# Altium project 海关全向控制器主控板V3.PrjPcb
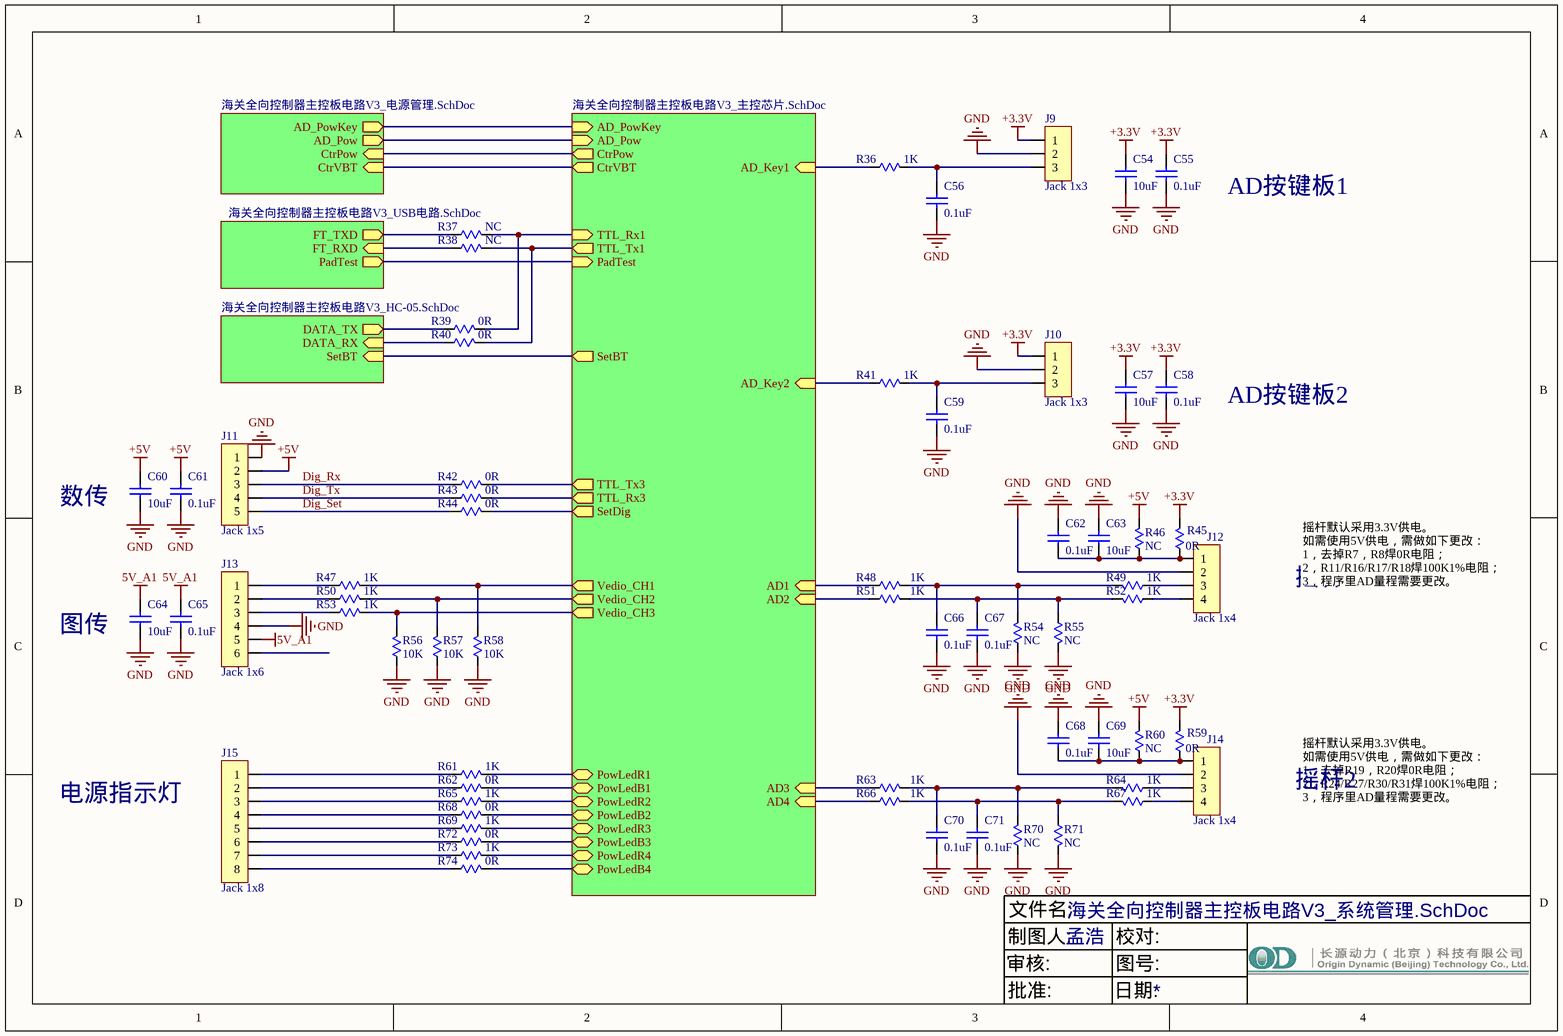
[diagram p0: 海关全向控制器主控板电路V3_系统管理.SchDoc]
5 sheets, 192 parts. Net scope: hierarchical (ports join the sheet entries above them; power ports are global).
Board file: 海关全向控制器主控板电路V3.PcbDoc
Sheets:
  海关全向控制器主控板电路V3_系统管理.SchDoc
    Designator = 海关全向控制器主控板电路V3_电源管理.SchDoc
    Designator = 海关全向控制器主控板电路V3_USB电路.SchDoc
    Designator = 海关全向控制器主控板电路V3_主控芯片.SchDoc
    Designator = 海关全向控制器主控板电路V3_HC-05.SchDoc

## Sheet 海关全向控制器主控板电路V3_系统管理.SchDoc
size A4

### Parts
C54  10uF  [C0805]
C55  0.1uF  [C0805]
C56  0.1uF  [C0805]
C57  10uF  [C0805]
C58  0.1uF  [C0805]
C59  0.1uF  [C0805]
C60  10uF  [C0805]
C61  0.1uF  [C0805]
C62  0.1uF  [C0805]
C63  10uF  [C0805]
C64  10uF  [C0805]
C65  0.1uF  [C0805]
C66  0.1uF  [C0805]
C67  0.1uF  [C0805]
C68  0.1uF  [C0805]
C69  10uF  [C0805]
C70  0.1uF  [C0805]
C71  0.1uF  [C0805]
J9  Jack 1x3  [ZH-3AWD]
J10  Jack 1x3  [ZH-3AWD]
J11  Jack 1x5  [ZH-5AWD]
J12  Jack 1x4  [ZH-4AWD]
J13  Jack 1x6  [ZH-6AWD]
J14  Jack 1x4  [ZH-4AWD]
J15  Jack 1x8  [ZH-8AWD]
R36  1K  [R0805]
R37  NC  [R0805]
R38  NC  [R0805]
R39  0R  [R0805]
R40  0R  [R0805]
R41  1K  [R0805]
R42  0R  [R0805]
R43  0R  [R0805]
R44  0R  [R0805]
R45  0R  [R0805]
R46  NC  [R0805]
R47  1K  [R0805]
R48  1K  [R0805]
R49  1K  [R0805]
R50  1K  [R0805]
R51  1K  [R0805]
R52  1K  [R0805]
R53  1K  [R0805]
R54  NC  [R0805]
R55  NC  [R0805]
R56  10K  [R0805]
R57  10K  [R0805]
R58  10K  [R0805]
R59  0R  [R0805]
R60  NC  [R0805]
R61  1K  [R0805]
R62  0R  [R0805]
R63  1K  [R0805]
R64  1K  [R0805]
R65  1K  [R0805]
R66  1K  [R0805]
R67  1K  [R0805]
R68  0R  [R0805]
R69  1K  [R0805]
R70  NC  [R0805]
R71  NC  [R0805]
R72  0R  [R0805]
R73  1K  [R0805]
R74  0R  [R0805]

### Sub-sheets
Designator = 海关全向控制器主控板电路V3_电源管理.SchDoc: AD_PowKey (out), AD_Pow (out), CtrPow (in), CtrVBT (in)
Designator = 海关全向控制器主控板电路V3_USB电路.SchDoc: FT_RXD (in), FT_TXD (out), PadTest (out)
Designator = 海关全向控制器主控板电路V3_主控芯片.SchDoc: AD_PowKey (in), AD_Pow (in), CtrPow (out), TTL_Rx1 (in), TTL_Tx1 (out), AD_Key1 (in), AD1 (in), AD2 (in), AD3 (in), AD4 (in), TTL_Tx3 (out), TTL_Rx3 (out), Vedio_CH1 (out), Vedio_CH2 (out), Vedio_CH3 (out), AD_Key2 (in), PowLedR1 (bidir), PowLedR2 (bidir), PowLedR3 (bidir), PowLedB1 (bidir), PowLedB2 (bidir), PowLedB3 (bidir), SetDig (out), PowLedR4 (bidir), PowLedB4 (bidir), SetBT (out), PadTest (in), CtrVBT (out)
Designator = 海关全向控制器主控板电路V3_HC-05.SchDoc: DATA_RX (in), DATA_TX (out), SetBT (in)

### Nets
5V_A1: C64.1 C65.1 J13.5
+3.3V: C54.1 C55.1 C57.1 C58.1 J9.1 J10.1 R45.1 R59.1
+5V: C60.1 C61.1 J11.2 R46.1 R60.1
GND: C54.2 C55.2 C56.2 C57.2 C58.2 C59.2 C60.2 C61.2 C62.1 C63.1 C64.2 C65.2 C66.2 C67.2 C68.1 C69.1 C70.2 C71.2 J9.2 J10.2 J11.1 J12.2 J13.4 J14.2 R54.2 R55.1 R56.1 R57.1 R58.1 R70.2 R71.1
AD1: R48.2 ; sheet Designator/AD1
AD2: R51.2 ; sheet Designator/AD2
AD3: R63.2 ; sheet Designator/AD3
AD4: R66.2 ; sheet Designator/AD4
AD_Key1: R36.1 ; sheet Designator/AD_Key1
AD_Key2: R41.1 ; sheet Designator/AD_Key2
AD_Pow: sheet Designator/AD_Pow, sheet Designator/AD_Pow
AD_PowKey: sheet Designator/AD_PowKey, sheet Designator/AD_PowKey
CtrPow: sheet Designator/CtrPow, sheet Designator/CtrPow
CtrVBT: sheet Designator/CtrVBT, sheet Designator/CtrVBT
DATA_RX: R40.2 ; sheet Designator/DATA_RX
DATA_TX: R39.2 ; sheet Designator/DATA_TX
Dig_Rx: J11.3 R42.1
Dig_Set: J11.5 R44.1
Dig_Tx: J11.4 R43.1
PadTest: sheet Designator/PadTest, sheet Designator/PadTest
PowLedB1: R62.2 ; sheet Designator/PowLedB1
PowLedB2: R68.2 ; sheet Designator/PowLedB2
PowLedB3: R72.2 ; sheet Designator/PowLedB3
PowLedB4: R74.2 ; sheet Designator/PowLedB4
PowLedR1: R61.2 ; sheet Designator/PowLedR1
PowLedR2: R65.2 ; sheet Designator/PowLedR2
PowLedR3: R69.2 ; sheet Designator/PowLedR3
PowLedR4: R73.2 ; sheet Designator/PowLedR4
SetBT: sheet Designator/SetBT, sheet Designator/SetBT
SetDig: R44.2 ; sheet Designator/SetDig
TTL_Rx1: R37.1 R39.1 ; sheet Designator/TTL_Rx1
TTL_Rx3: R43.2 ; sheet Designator/TTL_Rx3
TTL_Tx1: R38.1 R40.1 ; sheet Designator/TTL_Tx1
TTL_Tx3: R42.2 ; sheet Designator/TTL_Tx3
Vedio_CH1: R47.2 R58.2 ; sheet Designator/Vedio_CH1
Vedio_CH2: R50.2 R57.2 ; sheet Designator/Vedio_CH2
Vedio_CH3: R53.2 R56.2 ; sheet Designator/Vedio_CH3
NetC56_1: C56.1 J9.3 R36.2
NetC59_1: C59.1 J10.3 R41.2
NetC62_2: C62.2 C63.2 J12.1 R45.2 R46.2
NetC66_1: C66.1 R48.1 R49.1 R54.1
NetC67_1: C67.1 R51.1 R52.1 R55.2
NetC68_2: C68.2 C69.2 J14.1 R59.2 R60.2
NetC70_1: C70.1 R63.1 R64.1 R70.1
NetC71_1: C71.1 R66.1 R67.1 R71.2
NetJ12_3: J12.3 R49.2
NetJ12_4: J12.4 R52.2
NetJ13_1: J13.1 R47.1
NetJ13_2: J13.2 R50.1
NetJ13_3: J13.3 R53.1
NetJ14_3: J14.3 R64.2
NetJ14_4: J14.4 R67.2
NetJ15_1: J15.1 R61.1
NetJ15_2: J15.2 R62.1
NetJ15_3: J15.3 R65.1
NetJ15_4: J15.4 R68.1
NetJ15_5: J15.5 R69.1
NetJ15_6: J15.6 R72.1
NetJ15_7: J15.7 R73.1
NetJ15_8: J15.8 R74.1
NetR37_2: R37.2 ; sheet Designator/FT_TXD
NetR38_2: R38.2 ; sheet Designator/FT_RXD

Not connected (* = marked no-connect by the designer): J13 6

### Notes on the sheet
- AD按键板1
- AD按键板2
- 数传
- 摇杆默认采用3.3V供电。
  如需使用5V供电，需做如下更改：
  1，去掉R7，R8焊0R电阻；
  2，R11/R16/R17/R18焊100K1%电阻；
  3，程序里AD量程需要更改。
- 图传
- 摇杆1
- 摇杆2
- 电源指示灯
- 摇杆默认采用3.3V供电。
  如需使用5V供电，需做如下更改：
  1，去掉R19，R20焊0R电阻；
  2，R24/R27/R30/R31焊100K1%电阻；
  3，程序里AD量程需要更改。
- 文件名:
- 审核:
- 制图人:
- 孟浩
- 校对:
- 图号:
- 批准:
- 日期:

### Library data of the parts
C54-C71 = Cap: Capacitor; Published: 8-Jun-2000; Revision: July-2002: Re-released for DXP Platform.; Publisher: Altium Limited
  C54 C57 C60 C63 C64 C69: Value: 10uF
  C55 C56 C58 C59 C61 C62 C65-C68 C70 C71: Value: 0.1uF
J9 J10 = Jack 1x3: 插座
J11 = Jack 1x5: 插座
J12 J14 = Jack 1x4: 插座
J13 = Jack 1x6: 插座
J15 = Jack 1x8: 插座
R36-R74 = Res: Resistor; Published: 8-Jun-2000; LatestRevisionDate: 04-Mar-2005; LatestRevisionNote: PCB Footprint replaced.; PackageReference: J1-0603; Publisher: Altium Limited
  R36 R41 R47-R53 R63 R64 R66 R67: Value: 1K
  R37 R38 R46 R54 R55 R60 R70 R71: Value: NC
  R39 R40 R42-R45 R59 R62 R68 R72 R74: Value: 0R
  R56-R58: Value: 10K

## Sheet 海关全向控制器主控板电路V3_电源管理.SchDoc
size A4
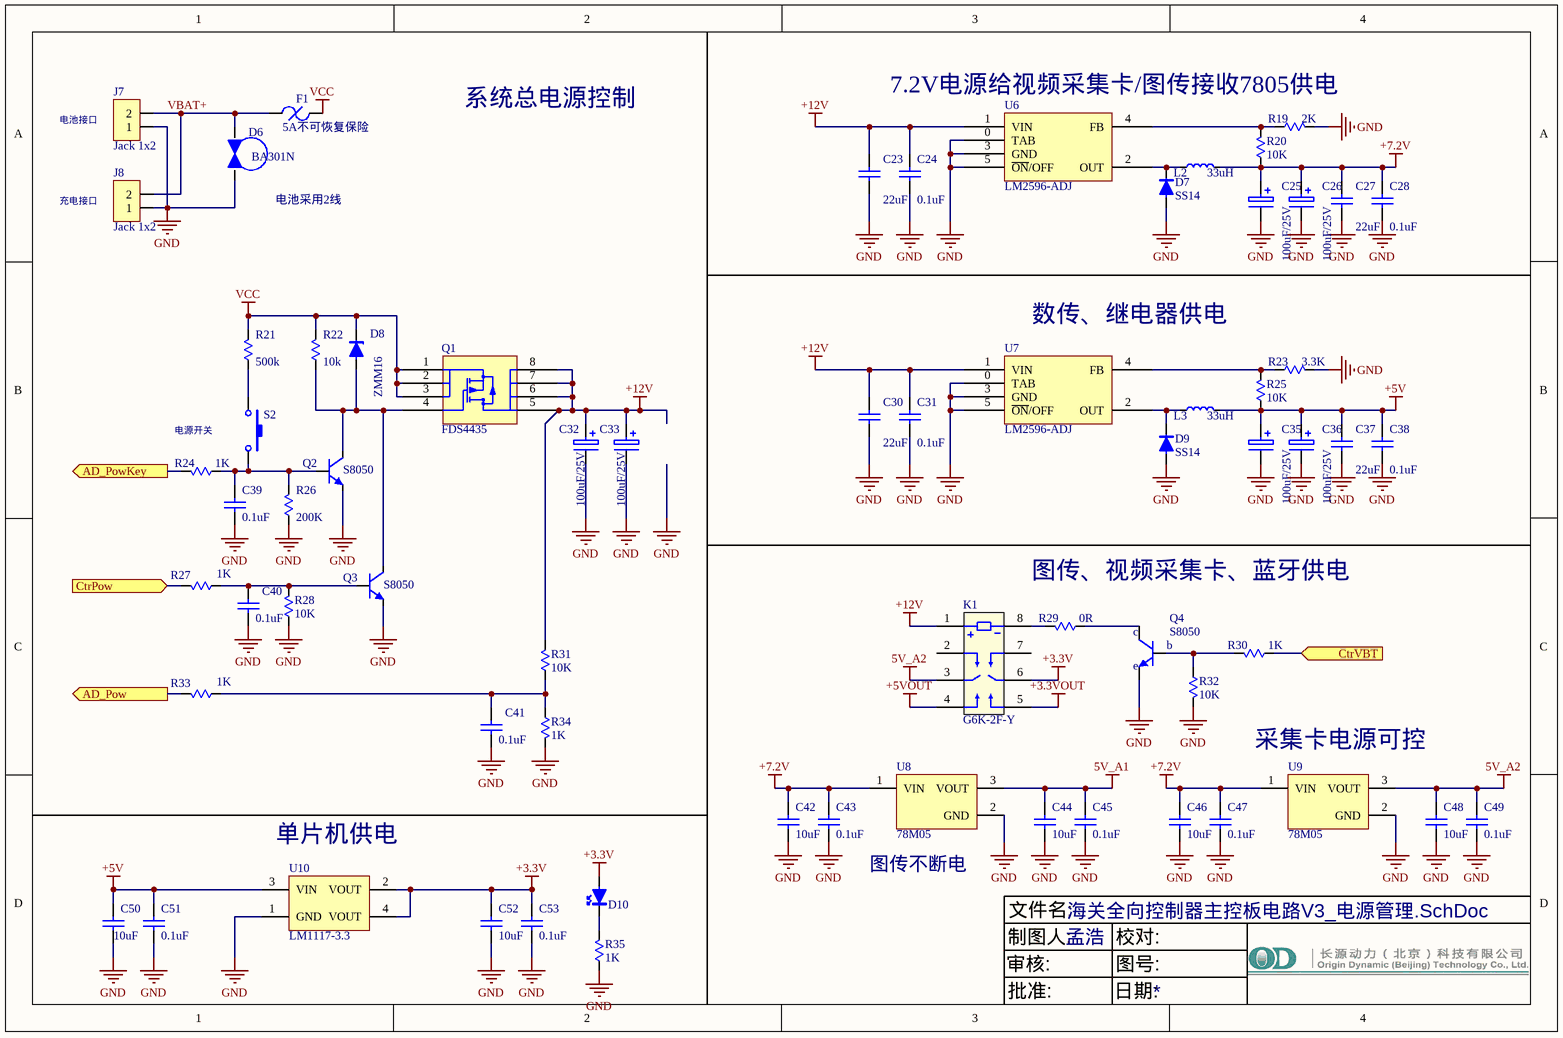
[diagram p1: 海关全向控制器主控板电路V3_电源管理.SchDoc]

### Parts
C23  22uF  [C1210]
C24  0.1uF  [C0805]
C25  100uF/25V  [C7343]
C26  100uF/25V  [C7343]
C27  22uF  [C1210]
C28  0.1uF  [C0805]
C30  22uF  [C1210]
C31  0.1uF  [C0805]
C32  100uF/25V  [C7343]
C33  100uF/25V  [C7343]
C35  100uF/25V  [C7343]
C36  100uF/25V  [C7343]
C37  22uF  [C1210]
C38  0.1uF  [C0805]
C39  0.1uF  [C0805]
C40  0.1uF  [C0805]
C41  0.1uF  [C0805]
C42  10uF  [C0805]
C43  0.1uF  [C0805]
C44  10uF  [C0805]
C45  0.1uF  [C0805]
C46  10uF  [C0805]
C47  0.1uF  [C0805]
C48  10uF  [C0805]
C49  0.1uF  [C0805]
C50  10uF  [C0805]
C51  0.1uF  [C0805]
C52  10uF  [C0805]
C53  0.1uF  [C0805]
D6  BA301N  [BA301N]
D7  SS14  [SMA]
D8  ZMM16  [SOD-80-S]
D9  SS14  [SMA]
D10  LED  [LED0603]  (value not drawn)
F1  5A不可恢复保险  [F1808]
J7  Jack 1x2  [35363-0260]
J8  Jack 1x2  [35363-0260]
K1  G6K-2F-Y  [G6K-2F-Y]
L2  33uH  [L6.6*7.1mm]
L3  33uH  [L6.6*7.1mm]
Q1  FDS4435  [SO8]
Q2  S8050  [SOT-23]
Q3  S8050  [SOT-23]
Q4  S8050  [SOT-23]
R19  2K  [R0805]
R20  10K  [R0805]
R21  500k  [R0805]
R22  10k  [R0805]
R23  3.3K  [R0805]
R24  1K  [R0805]
R25  10K  [R0805]
R26  200K  [R0805]
R27  1K  [R0805]
R28  10K  [R0805]
R29  0R  [R0805]
R30  1K  [R0805]
R31  10K  [R0805]
R32  10K  [R0805]
R33  1K  [R0805]
R34  1K  [R0805]
R35  1K  [R0805]
S2  SW-PB  [ZH-2AWD]  (value not drawn)
U6  LM2596-ADJ  [TO-263-5]
U7  LM2596-ADJ  [TO-263-5]
U8  78M05  [TO-252]
U9  78M05  [TO-252]
U10  LM1117-3.3  [SOT-223]

### Ports
AD_Pow (out), AD_PowKey (out), CtrPow (in), CtrVBT (in)

### Nets
5V_A1: C44.1 C45.2 U8.3(VOUT)
5V_A2: C48.1 C49.2 K1.3 U9.3(VOUT)
+3.3V: C52.1 C53.2 D10.1(A) K1.6 U10.2(VOUT) U10.4(VOUT)
+3.3VOUT: K1.5
+5V: C35.1 C36.1 C37.1 C38.2 C50.1 C51.2 L3.2 R25.1 U10.3(VIN)
+5VOUT: K1.4
+7.2V: C25.1 C26.1 C27.1 C28.2 C42.1 C43.2 C46.1 C47.2 L2.2 R20.1 U8.1(VIN) U9.1(VIN)
+12V: C23.1 C24.2 C30.1 C31.2 C32.1 C33.1 K1.1 Q1.5 Q1.6 Q1.7 Q1.8 R31.1 U6.1(VIN) U7.1(VIN)
GND: C23.2 C24.1 C25.2 C26.2 C27.2 C28.1 C30.2 C31.1 C32.2 C33.2 C35.2 C36.2 C37.2 C38.1 C39.1 C40.1 C41.1 C42.2 C43.1 C44.2 C45.1 C46.2 C47.1 C48.2 C49.1 C50.2 C51.1 C52.2 C53.1 D6.2 D7.1(A) D9.1(A) J7.1 J8.1 Q2.2(E) Q3.2(E) Q4.2(e) R19.2 R23.2 R26.2 R28.2 R32.2 R34.1 R35.1 U6.0(TAB) U6.3(GND) U6.5(~{ON}/OFF) U7.0(TAB) U7.3(GND) U7.5(~{ON}/OFF) U8.2(GND) U9.2(GND) U10.1(GND)
VCC: D8.2(K) F1.2 Q1.1 Q1.2 Q1.3 R21.2 R22.2
AD_Pow: R33.1 ; port AD_Pow
AD_PowKey: R24.1 ; port AD_PowKey
CtrPow: R27.1 ; port CtrPow
CtrVBT: R30.1 ; port CtrVBT
VBAT+: D6.1 F1.1 J7.2 J8.2
NetC39_2: C39.2 Q2.1(B) R24.2 R26.1 S2.2
NetC40_2: C40.2 Q3.1(B) R27.2 R28.1
NetC41_2: C41.2 R31.2 R33.2 R34.2
NetD7_2: D7.2(K) L2.1 U6.2(OUT)
NetD8_1: D8.1(A) Q1.4 Q2.3(C) Q3.3(C) R22.1
NetD9_2: D9.2(K) L3.1 U7.2(OUT)
NetD10_2: D10.2(K) R35.2
NetK1_8: K1.8 R29.2
NetQ4_1: Q4.1(b) R30.2 R32.1
NetQ4_3: Q4.3(c) R29.1
NetR19_1: R19.1 R20.2 U6.4(FB)
NetR21_1: R21.1 S2.1
NetR23_1: R23.1 R25.2 U7.4(FB)

Not connected (* = marked no-connect by the designer): K1 2 7

### Notes on the sheet
- 系统总电源控制
- (near U6) 7.2V电源给视频采集卡/图传接收7805供电
- 电池接口
- 充电接口
- (near D6) 电池采用2线
- (near U7) 数传、继电器供电
- (near R24) 电源开关
- 图传、视频采集卡、蓝牙供电
- (near U9) 采集卡电源可控
- (near U10) 单片机供电
- 图传不断电
- 文件名:
- 审核:
- 制图人:
- 孟浩
- 校对:
- 图号:
- 批准:
- 日期:

### Library data of the parts
C23 C24 C27 C28 C30 C31 C37-C53 = CAP: Published: 8-Jun-2000; LatestRevisionDate: 17-Jul-2002; LatestRevisionNote: Re-released for DXP Platform.; PackageReference: RAD-0.3; Publisher: Altium Limited
  C23 C27 C30 C37: Value: 22uF
  C24 C28 C31 C38-C41 C43 C45 C47 C49 C51 C53: Value: 0.1uF
  C42 C44 C46 C48 C50 C52: Value: 10uF
C25 C26 C35 C36 = ELECTRO: Electrolytic Capacitor
C32 C33 = Cap Poll
D7 D9 = Diode-Switch: Silicon Epitaxial Planar Diodes
D8 = DIODE-ZENER: Small Signal Zener Diodes
F1 = Fuse2
J7 J8 = Jack 1x2: 插座
L2 L3 = INDUCTOR: Code_IEC: 1005; Published: 8-Jun-2000; LatestRevisionDate: 17-Jul-2002; LatestRevisionNote: Re-released for DXP Platform.; PackageReference: 0402-A; Publisher: Altium Limited; Code_JEITA: 0402; Value: 33uH
Q2 Q3 = NPN: NPN General Purpose Amplifier; Published: 8-Jun-2000; LatestRevisionDate: 15-Jan-2003; LatestRevisionNote: PCB Footprint 'BCY-W3/D4.7' replaced; DatasheetDocument: 1997; PackageDocument: Sep-1998; PackageReference: TO-92A; Publisher: Altium Limited; Code_JEDEC: TO-92A; ComponentLink1Description: Manufacturer Link; ComponentLink1URL: http://www.fairchildsemi.com/; ComponentLink2Description: Datasheet; ComponentLink2URL: http://www.fairchildsemi.com/ds/2N%2F2N3904.pdf
Q4 = S8050: NPN triode, 0.5A Max
R19 R20 R23 R25 R29 R30 R32 = RES: Resistor; Published: 8-Jun-2000; LatestRevisionDate: 17-Jul-2002; LatestRevisionNote: Re-released for DXP Platform.; PackageReference: AXIAL-0.3; Publisher: Altium Limited
  R19: Value: 2K
  R20 R25: Value: 10K
  R23: Value: 3.3K
R21 R22 R24 R26-R28 R31 R33-R35 = Res: Resistor; Published: 8-Jun-2000; LatestRevisionDate: 04-Mar-2005; LatestRevisionNote: PCB Footprint replaced.; PackageReference: J1-0603; Publisher: Altium Limited
  R21: Value: 500k
  R22: Value: 10k
  R26: Value: 200K
  R27 R33-R35: Value: 1K
  R28 R31: Value: 10K
S2 = SW-PB: Switch; Published: 24-Mar-1999; LatestRevisionDate: 17-Jul-2002; LatestRevisionNote: Re-released for DXP Platform.; PackageReference: SPST-2; Publisher: Altium Limited; PackageDescription: Switch; 2 Leads
U6 U7 = LM25x6-5: LM2596-5;LM2576-5
U10 = LM1117: 800mA Linear Voltage Regulator

## Sheet 海关全向控制器主控板电路V3_USB电路.SchDoc
size A4
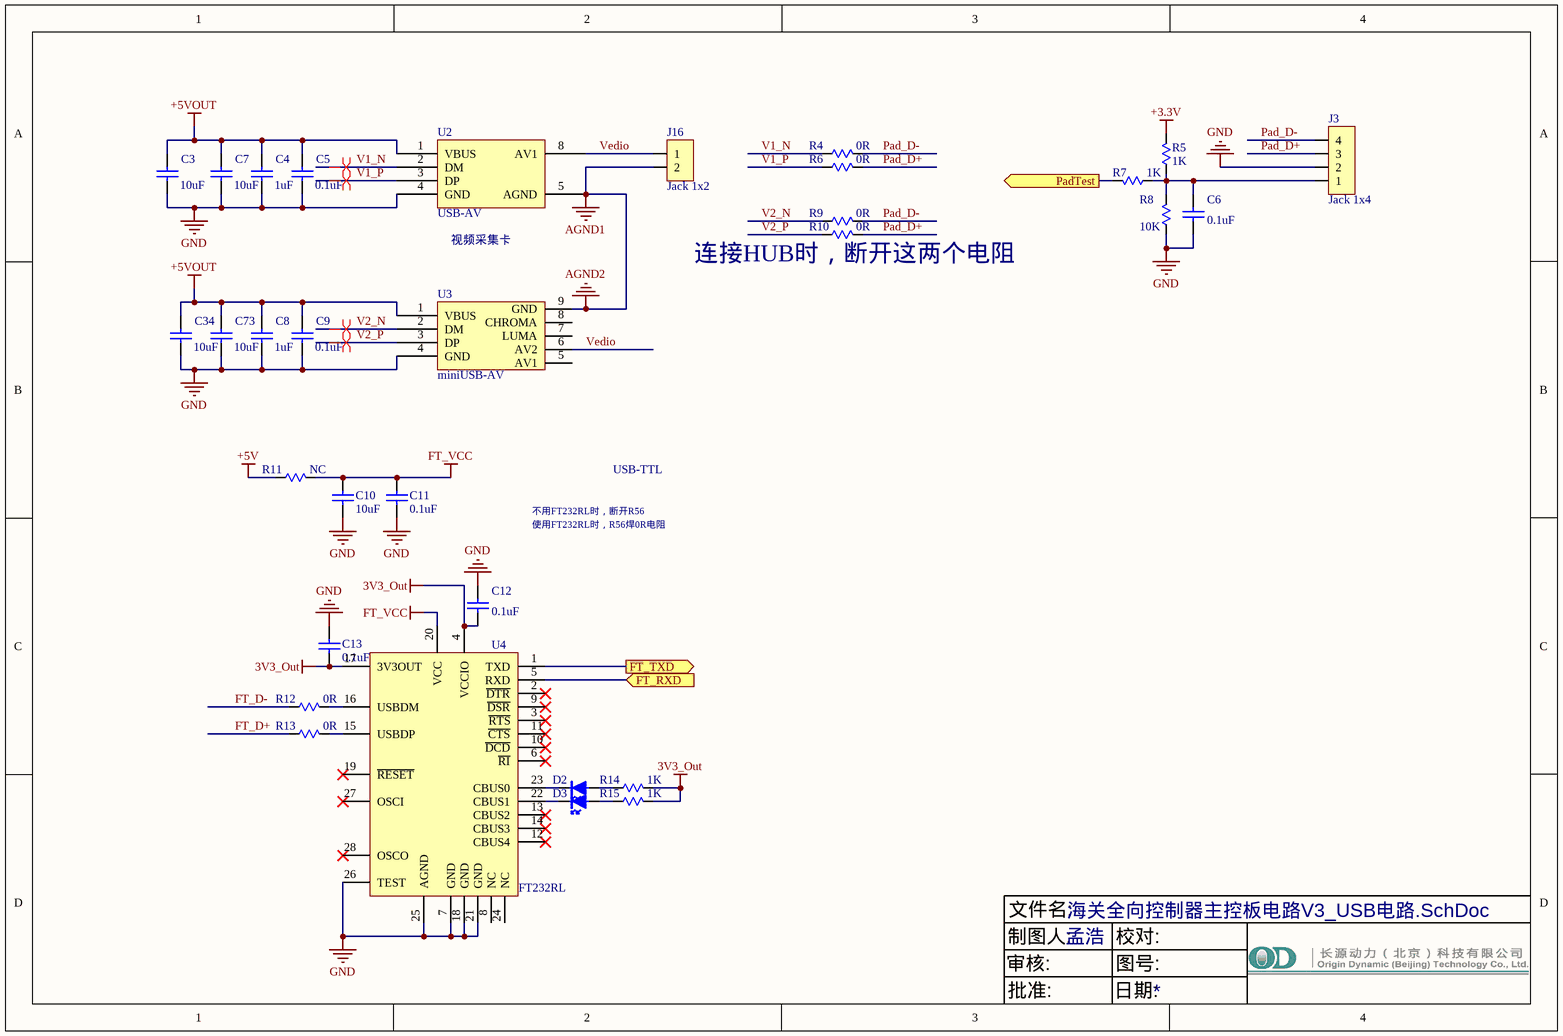
[diagram p2: 海关全向控制器主控板电路V3_USB电路.SchDoc]

### Parts
C3  10uF  [C0805]
C4  1uF  [C0805]
C5  0.1uF  [C0805]
C6  0.1uF  [C0805]
C7  10uF  [C0805]
C8  1uF  [C0805]
C9  0.1uF  [C0805]
C10  10uF  [C0805]
C11  0.1uF  [C0805]
C12  0.1uF  [C0805]
C13  0.1uF  [C0805]
C34  10uF  [C0805]
C73  10uF  [C0805]
D2  LED  [LED0603]  (value not drawn)
D3  LED  [LED0603]  (value not drawn)
J3  Jack 1x4  [35363-0460]
J16  Jack 1x2  [35363-0260]
R4  0R  [R0805]
R5  1K  [R0805]
R6  0R  [R0805]
R7  1K  [R0805]
R8  10K  [R0805]
R9  0R  [R0805]
R10  0R  [R0805]
R11  NC  [R0805]
R12  0R  [R0805]
R13  0R  [R0805]
R14  1K  [R0805]
R15  1K  [R0805]
U2  USB-AV  [USB-AV]
U3  miniUSB-AV  [miniUSB-AV]
U4  FT232RL  [SSOP-28]

### Ports
FT_RXD (in), FT_TXD (out), PadTest (out)

### Nets
3V3_Out: C12.2 C13.1 R14.1 R15.1 U4.4(VCCIO) U4.17(3V3OUT)
+3.3V: R5.1
+5V: R11.2
+5VOUT: C3.1 C4.1 C5.2 C7.1 C8.1 C9.2 C34.1 C73.1 U2.1(VBUS) U3.1(VBUS)
AGND1: J16.2 U2.5(AGND) U3.9(GND)  [also labelled AGND2]
FT_VCC: C10.1 C11.2 R11.1 U4.20(VCC)
GND: C3.2 C4.2 C5.1 C6.2 C7.2 C8.2 C9.1 C10.2 C11.1 C12.1 C13.2 C34.2 C73.2 J3.2 R8.2 U2.4(GND) U3.4(GND) U4.7(GND) U4.18(GND) U4.21(GND) U4.25(AGND) U4.26(TEST)
FT_D+: R13.2
FT_D-: R12.2
Pad_D+: J3.3 R6.1 R10.1
Pad_D-: J3.4 R4.1 R9.1
PadTest: R7.1 ; port PadTest
V1_N: R4.2 U2.2(DM)
V1_P: R6.2 U2.3(DP)
V2_N: R9.2 U3.2(DM)
V2_P: R10.2 U3.3(DP)
Vedio: J16.1 U2.8(AV1) U3.6(AV2)
NetC6_1: C6.1 J3.1 R5.2 R7.2 R8.1
NetD2_1: D2.1(A) R14.2
NetD2_2: D2.2(K) U4.23(CBUS0)
NetD3_1: D3.1(A) R15.2
NetD3_2: D3.2(K) U4.22(CBUS1)
NetR12_1: R12.1 U4.16(USBDM)
NetR13_1: R13.1 U4.15(USBDP)
NetR37_2: U4.1(TXD) ; port FT_TXD
NetR38_2: U4.5(RXD) ; port FT_RXD

Not connected (* = marked no-connect by the designer): U3 5(AV1) 7(LUMA) 8(CHROMA); U4 2(~{DTR})* 3(~{RTS})* 6(~{RI})* 8(NC) 9(~{DSR})* 10(~{DCD})* 11(~{CTS})* 12(CBUS4)* 13(CBUS2)* 14(CBUS3)* 19(~{RESET})* 24(NC) 27(OSCI)* 28(OSCO)*

### Layout directives
differential pair: V1_N, V1_P, V2_N, V2_P

### Notes on the sheet
- 视频采集卡
- (near R10) 连接HUB时，断开这两个电阻
- 不用FT232RL时，断开R56
- USB-TTL
- 使用FT232RL时，R56焊0R电阻
- 文件名:
- 审核:
- 制图人:
- 孟浩
- 校对:
- 图号:
- 批准:
- 日期:

### Library data of the parts
C3 C4 C7 C8 C10 C34 C73 = CAP: Published: 8-Jun-2000; LatestRevisionDate: 17-Jul-2002; LatestRevisionNote: Re-released for DXP Platform.; PackageReference: RAD-0.3; Publisher: Altium Limited
  C3 C7 C10 C34 C73: Value: 10uF
  C4 C8: Value: 1uF
C5 C9 C11 C13 = Cap Semi
C6 C12 = Cap: Capacitor; Value: 22pF; Published: 8-Jun-2000; Revision: July-2002: Re-released for DXP Platform.; Publisher: Altium Limited
J3 = Jack 1x4: 插座
J16 = Jack 1x2: 插座
R4-R15 = Res: Resistor; Published: 8-Jun-2000; LatestRevisionDate: 04-Mar-2005; LatestRevisionNote: PCB Footprint replaced.; PackageReference: J1-0603; Publisher: Altium Limited
  R4 R6 R9 R10 R12 R13: Value: 0R
  R5 R7 R14 R15: Value: 1K
  R8: Value: 10K
  R11: Value: NC

## Sheet 海关全向控制器主控板电路V3_主控芯片.SchDoc
size A4
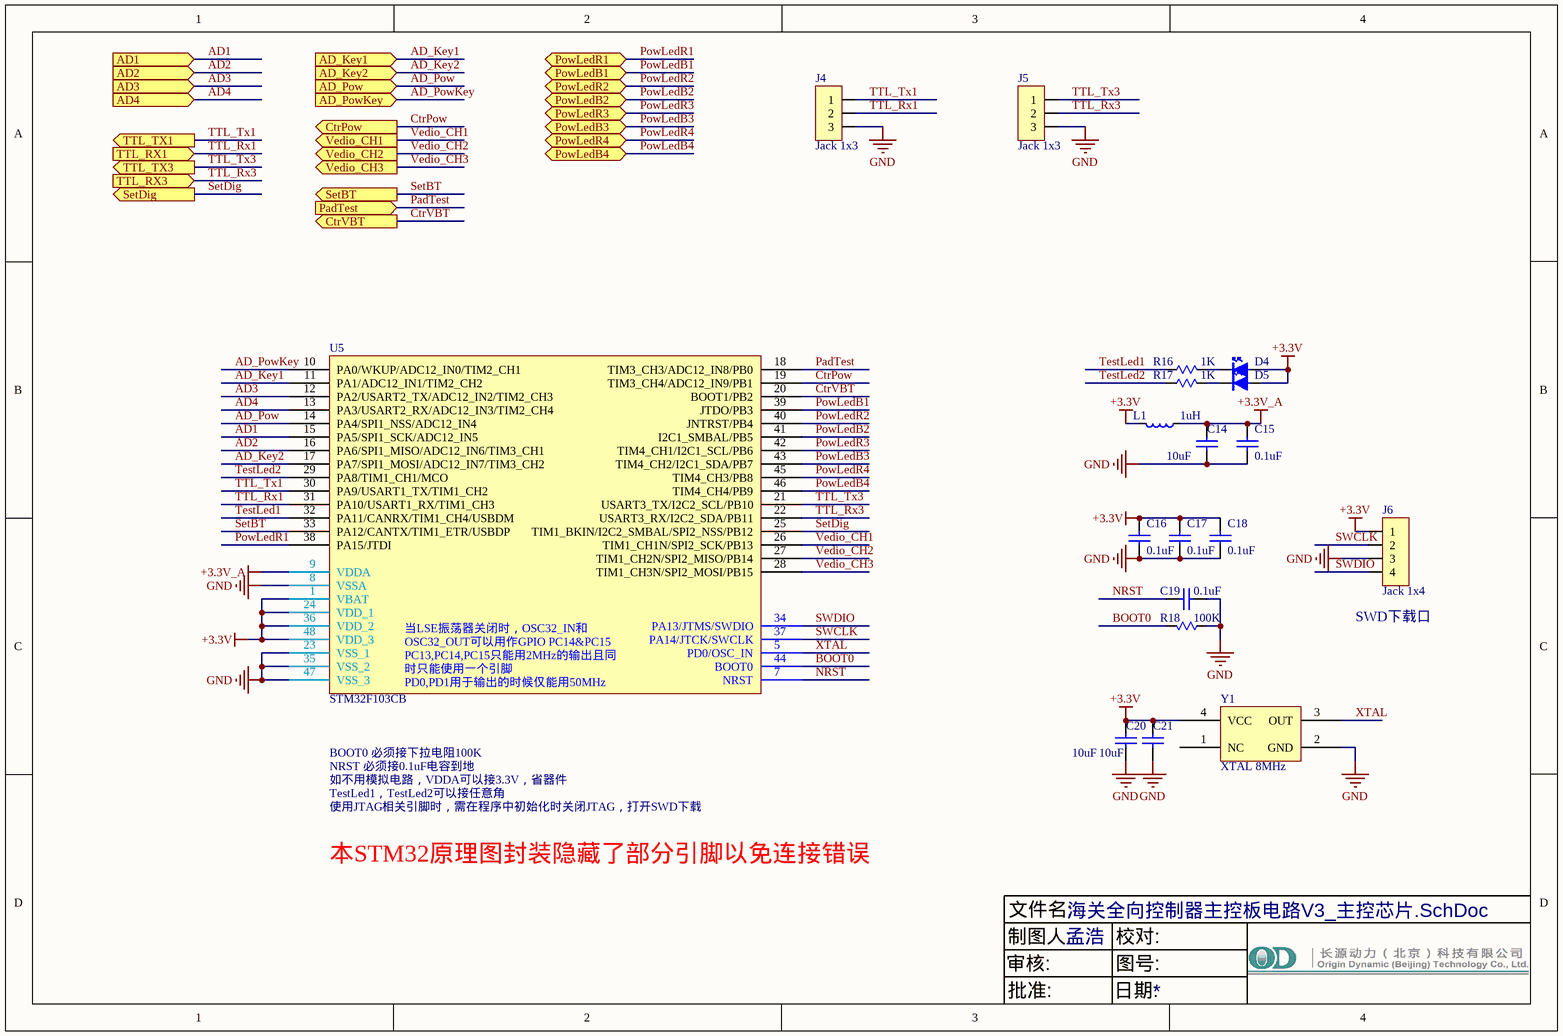
[diagram p3: 海关全向控制器主控板电路V3_主控芯片.SchDoc]

### Parts
C14  10uF  [C0805]
C15  0.1uF  [C0805]
C16  0.1uF  [C0805]
C17  0.1uF  [C0805]
C18  0.1uF  [C0805]
C19  0.1uF  [C0805]
C20  10uF  [C0805]
C21  10uF  [C0805]
D4  LED  [LED0603]  (value not drawn)
D5  LED  [LED0603]  (value not drawn)
J4  Jack 1x3  [Jk1*3-2.0]
J5  Jack 1x3  [Jk1*3-2.0]
J6  Jack 1x4  [Jk1*4-2.0]
L1  1uH  [L0805]
R16  1K  [R0805]
R17  1K  [R0805]
R18  100K  [R0805]
U5  STM32F103CB  [LQF48]
Y1  XTAL 8MHz  [XTAL5032]

### Ports
AD1 (in), AD2 (in), AD3 (in), AD4 (in), AD_Key1 (in), AD_Key2 (in), AD_Pow (in), AD_PowKey (in), CtrPow (out), CtrVBT (out), PadTest (in), PowLedB1 (bidir), PowLedB2 (bidir), PowLedB3 (bidir), PowLedB4 (bidir), PowLedR1 (bidir), PowLedR2 (bidir), PowLedR3 (bidir), PowLedR4 (bidir), SetBT (out), SetDig (out), TTL_RX1 (in), TTL_RX3 (in), TTL_TX1 (out), TTL_TX3 (out), Vedio_CH1 (out), Vedio_CH2 (out), Vedio_CH3 (out)

### Nets
+3.3V: C16.1 C17.1 C18.1 C20.2 C21.2 D4.1(A) D5.1(A) J6.1 L1.1 U5.1(VBAT) U5.24(VDD_1) U5.36(VDD_2) U5.48(VDD_3) Y1.4(VCC)
+3.3V_A: C14.2 C15.1 L1.2 U5.9(VDDA)
GND: C14.1 C15.2 C16.2 C17.2 C18.2 C19.2 C20.1 C21.1 J4.3 J5.3 J6.3 R18.1 U5.8(VSSA) U5.23(VSS_1) U5.35(VSS_2) U5.47(VSS_3) Y1.2(GND)
AD1: U5.15(PA5/SPI1_SCK/ADC12_IN5) ; port AD1
AD2: U5.16(PA6/SPI1_MISO/ADC12_IN6/TIM3_CH1) ; port AD2
AD3: U5.12(PA2/USART2_TX/ADC12_IN2/TIM2_CH3) ; port AD3
AD4: U5.13(PA3/USART2_RX/ADC12_IN3/TIM2_CH4) ; port AD4
AD_Key1: U5.11(PA1/ADC12_IN1/TIM2_CH2) ; port AD_Key1
AD_Key2: U5.17(PA7/SPI1_MOSI/ADC12_IN7/TIM3_CH2) ; port AD_Key2
AD_Pow: U5.14(PA4/SPI1_NSS/ADC12_IN4) ; port AD_Pow
AD_PowKey: U5.10(PA0/WKUP/ADC12_IN0/TIM2_CH1) ; port AD_PowKey
BOOT0: R18.2 U5.44(BOOT0)
CtrPow: U5.19(TIM3_CH4/ADC12_IN9/PB1) ; port CtrPow
CtrVBT: U5.20(BOOT1/PB2) ; port CtrVBT
NRST: C19.1 U5.7(NRST)
PadTest: U5.18(TIM3_CH3/ADC12_IN8/PB0) ; port PadTest
PowLedB1: U5.39(JTDO/PB3) ; port PowLedB1
PowLedB2: U5.41(I2C1_SMBAL/PB5) ; port PowLedB2
PowLedB3: U5.43(TIM4_CH2/I2C1_SDA/PB7) ; port PowLedB3
PowLedB4: U5.46(TIM4_CH4/PB9) ; port PowLedB4
PowLedR1: U5.38(PA15/JTDI) ; port PowLedR1
PowLedR2: U5.40(JNTRST/PB4) ; port PowLedR2
PowLedR3: U5.42(TIM4_CH1/I2C1_SCL/PB6) ; port PowLedR3
PowLedR4: U5.45(TIM4_CH3/PB8) ; port PowLedR4
SetBT: U5.33(PA12/CANTX/TIM1_ETR/USBDP) ; port SetBT
SetDig: U5.25(TIM1_BKIN/I2C2_SMBAL/SPI2_NSS/PB12) ; port SetDig
SWCLK: J6.2 U5.37(PA14/JTCK/SWCLK)
SWDIO: J6.4 U5.34(PA13/JTMS/SWDIO)
TestLed1: R16.1 U5.32(PA11/CANRX/TIM1_CH4/USBDM)
TestLed2: R17.1 U5.29(PA8/TIM1_CH1/MCO)
TTL_Rx1: J4.2 U5.31(PA10/USART1_RX/TIM1_CH3) ; port TTL_RX1
TTL_Rx3: J5.2 U5.22(USART3_RX/I2C2_SDA/PB11) ; port TTL_RX3
TTL_Tx1: J4.1 U5.30(PA9/USART1_TX/TIM1_CH2) ; port TTL_TX1
TTL_Tx3: J5.1 U5.21(USART3_TX/I2C2_SCL/PB10) ; port TTL_TX3
Vedio_CH1: U5.26(TIM1_CH1N/SPI2_SCK/PB13) ; port Vedio_CH1
Vedio_CH2: U5.27(TIM1_CH2N/SPI2_MISO/PB14) ; port Vedio_CH2
Vedio_CH3: U5.28(TIM1_CH3N/SPI2_MOSI/PB15) ; port Vedio_CH3
XTAL: U5.5(PD0/OSC_IN) Y1.3(OUT)
NetD4_2: D4.2(K) R16.2
NetD5_2: D5.2(K) R17.2

Not connected (* = marked no-connect by the designer): U5 2(PC13-TAMPER-RTC) 3(PC14-OSC32_IN) 4(PC15-OSC32_OUT) 6(PD1/OSC_OUT); Y1 1(NC)

### Notes on the sheet
- (near J6) SWD下载口
- BOOT0 必须接下拉电阻100K
- NRST 必须接0.1uF电容到地
- 如不用模拟电路，VDDA可以接3.3V，省器件
- TestLed1，TestLed2可以接任意角
- 使用JTAG相关引脚时，需在程序中初始化时关闭JTAG，打开SWD下载
- 本STM32原理图封装隐藏了部分引脚以免连接错误
- 文件名:
- 审核:
- 制图人:
- 孟浩
- 校对:
- 图号:
- 批准:
- 日期:
- (in symbol STM32F103Cx) OSC32_IN和OSC32_OUT可以用作通用IO PC14和PC15; PC13,PC14,PC15只能用于2MHz的输出模式且同时只能使用一个引脚; 当LSE振荡器关闭时，OSC32_IN和OSC32_OUT可以用作GPIO PC14&PC15 / PC13,PC14,PC15只能用2MHz的输出且同时只能使用一个引脚 / PD0,PD1用于输出的时候仅能用50MHz

### Library data of the parts
C14-C21 = Cap: Capacitor; Published: 8-Jun-2000; Publisher: Altium Limited
  C14 C20 C21: LatestRevisionDate: 17-Jul-2002; LatestRevisionNote: Re-released for DXP Platform.; PackageReference: RAD-0.3; Value: 10uF
  C15-C19: Revision: July-2002: Re-released for DXP Platform.; Value: 0.1uF
J4 J5 = Jack 1x3: 插座
J6 = Jack 1x4: 插座
L1 = INDUCTOR: Code_IEC: 1005; Published: 8-Jun-2000; LatestRevisionDate: 17-Jul-2002; LatestRevisionNote: Re-released for DXP Platform.; PackageReference: 0402-A; Publisher: Altium Limited; Code_JEITA: 0402; Value: 1uH
R16 R17 = Res: Resistor; Published: 8-Jun-2000; LatestRevisionDate: 04-Mar-2005; LatestRevisionNote: PCB Footprint replaced.; PackageReference: J1-0603; Publisher: Altium Limited; Value: 1K
R18 = RES: Resistor; Published: 8-Jun-2000; LatestRevisionDate: 17-Jul-2002; LatestRevisionNote: Re-released for DXP Platform.; PackageReference: AXIAL-0.3; Publisher: Altium Limited; Value: 100K
U5 = STM32F103Cx
Y1 = XTAL

## Sheet 海关全向控制器主控板电路V3_HC-05.SchDoc
size A4
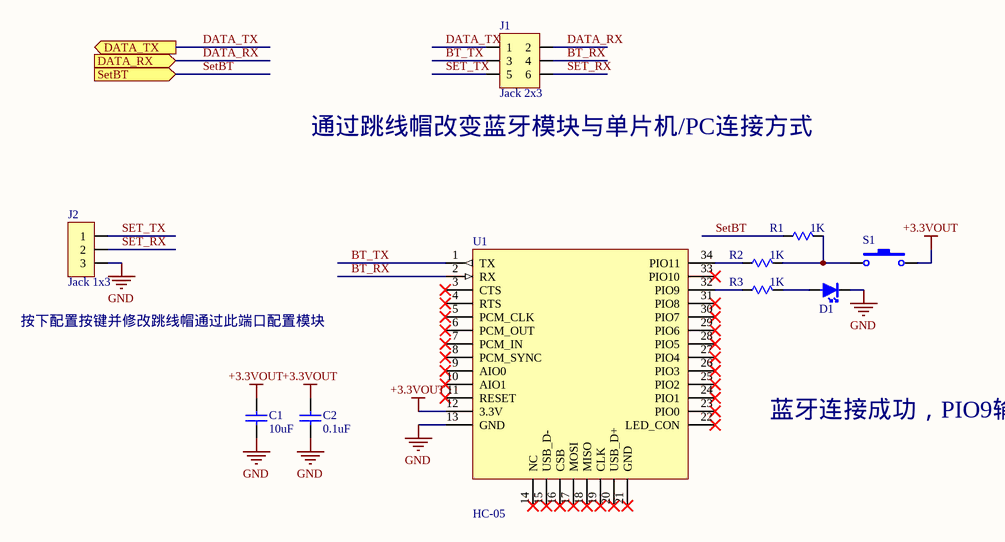
[diagram p4: 海关全向控制器主控板电路V3_HC-05.SchDoc]

### Parts
C1  10uF  [C0805]
C2  0.1uF  [C0805]
D1  LED  [LED0603]  (value not drawn)
J1  Jack 2x3  [Jk2*3-2.0]
J2  Jack 1x3  [Jk1*3-2.0]
R1  1K  [R0805]
R2  1K  [R0805]
R3  1K  [R0805]
S1  SW-PB  [Jk1*2-2.0]  (value not drawn)
U1  HC-05  [HC-05]

### Ports
DATA_RX (in), DATA_TX (out), SetBT (in)

### Nets
+3.3VOUT: C1.1 C2.2 S1.2 U1.12(3.3V)
GND: C1.2 C2.1 D1.2(K) J2.3 U1.13(GND)
BT_RX: J1.4 U1.2(RX)
BT_TX: J1.3 U1.1(TX)
DATA_RX: J1.2 ; port DATA_RX
DATA_TX: J1.1 ; port DATA_TX
SET_RX: J1.6 J2.2
SET_TX: J1.5 J2.1
SetBT: R1.2 ; port SetBT
NetD1_1: D1.1(A) R3.1
NetR1_1: R1.1 R2.1 S1.1
NetR2_2: R2.2 U1.34(PIO11)
NetR3_2: R3.2 U1.32(PIO9)

Not connected (* = marked no-connect by the designer): U1 3(CTS)* 4(RTS)* 5(PCM_CLK)* 6(PCM_OUT)* 7(PCM_IN)* 8(PCM_SYNC)* 9(AIO0)* 10(AIO1)* 11(RESET)* 14(NC)* 15(USB_D-)* 16(CSB)* 17(MOSI)* 18(MISO)* 19(CLK)* 20(USB_D+)* 21(GND)* 22(LED_CON)* 23(PIO0)* 24(PIO1)* 25(PIO2)* 26(PIO3)* 27(PIO4)* 28(PIO5)* 29(PIO6)* 30(PIO7)* 31(PIO8)* 33(PIO10)*

### Notes on the sheet
- (near J1) 通过跳线帽改变蓝牙模块与单片机/PC连接方式
- (near J2) 按下配置按键并修改跳线帽通过此端口配置模块
- 蓝牙连接成功，PIO9输出高电平

### Library data of the parts
C1 = CAP: Published: 8-Jun-2000; LatestRevisionDate: 17-Jul-2002; LatestRevisionNote: Re-released for DXP Platform.; PackageReference: RAD-0.3; Publisher: Altium Limited; Value: 10uF
C2 = Cap Semi
J1 = Jack 2x3: 双排座
J2 = Jack 1x3: 插座
R1-R3 = Res: Resistor; Published: 8-Jun-2000; LatestRevisionDate: 04-Mar-2005; LatestRevisionNote: PCB Footprint replaced.; PackageReference: J1-0603; Publisher: Altium Limited
S1 = SW-PB: Switch; Published: 24-Mar-1999; LatestRevisionDate: 17-Jul-2002; LatestRevisionNote: Re-released for DXP Platform.; PackageReference: SPST-2; Publisher: Altium Limited; PackageDescription: Switch; 2 Leads

## Nets that join several sheets
5V_A1: 海关全向控制器主控板电路V3_系统管理 (C64.1 C65.1 J13.5), 海关全向控制器主控板电路V3_电源管理 (C44.1 C45.2 U8.3)
+3.3V: 海关全向控制器主控板电路V3_系统管理 (8 pins), 海关全向控制器主控板电路V3_电源管理 (6 pins), 海关全向控制器主控板电路V3_USB电路 (R5.1), 海关全向控制器主控板电路V3_主控芯片 (14 pins)
+3.3VOUT: 海关全向控制器主控板电路V3_电源管理 (K1.5), 海关全向控制器主控板电路V3_HC-05 (C1.1 C2.2 S1.2 U1.12)
+5V: 海关全向控制器主控板电路V3_系统管理 (5 pins), 海关全向控制器主控板电路V3_电源管理 (9 pins), 海关全向控制器主控板电路V3_USB电路 (R11.2)
+5VOUT: 海关全向控制器主控板电路V3_电源管理 (K1.4), 海关全向控制器主控板电路V3_USB电路 (10 pins)
GND: 海关全向控制器主控板电路V3_系统管理 (31 pins), 海关全向控制器主控板电路V3_电源管理 (53 pins), 海关全向控制器主控板电路V3_USB电路 (22 pins), 海关全向控制器主控板电路V3_主控芯片 (17 pins), 海关全向控制器主控板电路V3_HC-05 (5 pins)
AD1: 海关全向控制器主控板电路V3_系统管理 (R48.2), 海关全向控制器主控板电路V3_主控芯片 (U5.15)
AD2: 海关全向控制器主控板电路V3_系统管理 (R51.2), 海关全向控制器主控板电路V3_主控芯片 (U5.16)
AD3: 海关全向控制器主控板电路V3_系统管理 (R63.2), 海关全向控制器主控板电路V3_主控芯片 (U5.12)
AD4: 海关全向控制器主控板电路V3_系统管理 (R66.2), 海关全向控制器主控板电路V3_主控芯片 (U5.13)
AD_Key1: 海关全向控制器主控板电路V3_系统管理 (R36.1), 海关全向控制器主控板电路V3_主控芯片 (U5.11)
AD_Key2: 海关全向控制器主控板电路V3_系统管理 (R41.1), 海关全向控制器主控板电路V3_主控芯片 (U5.17)
AD_Pow: 海关全向控制器主控板电路V3_电源管理 (R33.1), 海关全向控制器主控板电路V3_主控芯片 (U5.14)
AD_PowKey: 海关全向控制器主控板电路V3_电源管理 (R24.1), 海关全向控制器主控板电路V3_主控芯片 (U5.10)
CtrPow: 海关全向控制器主控板电路V3_电源管理 (R27.1), 海关全向控制器主控板电路V3_主控芯片 (U5.19)
CtrVBT: 海关全向控制器主控板电路V3_电源管理 (R30.1), 海关全向控制器主控板电路V3_主控芯片 (U5.20)
DATA_RX: 海关全向控制器主控板电路V3_系统管理 (R40.2), 海关全向控制器主控板电路V3_HC-05 (J1.2)
DATA_TX: 海关全向控制器主控板电路V3_系统管理 (R39.2), 海关全向控制器主控板电路V3_HC-05 (J1.1)
NetR37_2: 海关全向控制器主控板电路V3_系统管理 (R37.2), 海关全向控制器主控板电路V3_USB电路 (U4.1)
NetR38_2: 海关全向控制器主控板电路V3_系统管理 (R38.2), 海关全向控制器主控板电路V3_USB电路 (U4.5)
PadTest: 海关全向控制器主控板电路V3_USB电路 (R7.1), 海关全向控制器主控板电路V3_主控芯片 (U5.18)
PowLedB1: 海关全向控制器主控板电路V3_系统管理 (R62.2), 海关全向控制器主控板电路V3_主控芯片 (U5.39)
PowLedB2: 海关全向控制器主控板电路V3_系统管理 (R68.2), 海关全向控制器主控板电路V3_主控芯片 (U5.41)
PowLedB3: 海关全向控制器主控板电路V3_系统管理 (R72.2), 海关全向控制器主控板电路V3_主控芯片 (U5.43)
PowLedB4: 海关全向控制器主控板电路V3_系统管理 (R74.2), 海关全向控制器主控板电路V3_主控芯片 (U5.46)
PowLedR1: 海关全向控制器主控板电路V3_系统管理 (R61.2), 海关全向控制器主控板电路V3_主控芯片 (U5.38)
PowLedR2: 海关全向控制器主控板电路V3_系统管理 (R65.2), 海关全向控制器主控板电路V3_主控芯片 (U5.40)
PowLedR3: 海关全向控制器主控板电路V3_系统管理 (R69.2), 海关全向控制器主控板电路V3_主控芯片 (U5.42)
PowLedR4: 海关全向控制器主控板电路V3_系统管理 (R73.2), 海关全向控制器主控板电路V3_主控芯片 (U5.45)
SetBT: 海关全向控制器主控板电路V3_主控芯片 (U5.33), 海关全向控制器主控板电路V3_HC-05 (R1.2)
SetDig: 海关全向控制器主控板电路V3_系统管理 (R44.2), 海关全向控制器主控板电路V3_主控芯片 (U5.25)
TTL_Rx1: 海关全向控制器主控板电路V3_系统管理 (R37.1 R39.1), 海关全向控制器主控板电路V3_主控芯片 (J4.2 U5.31)
TTL_Rx3: 海关全向控制器主控板电路V3_系统管理 (R43.2), 海关全向控制器主控板电路V3_主控芯片 (J5.2 U5.22)
TTL_Tx1: 海关全向控制器主控板电路V3_系统管理 (R38.1 R40.1), 海关全向控制器主控板电路V3_主控芯片 (J4.1 U5.30)
TTL_Tx3: 海关全向控制器主控板电路V3_系统管理 (R42.2), 海关全向控制器主控板电路V3_主控芯片 (J5.1 U5.21)
Vedio_CH1: 海关全向控制器主控板电路V3_系统管理 (R47.2 R58.2), 海关全向控制器主控板电路V3_主控芯片 (U5.26)
Vedio_CH2: 海关全向控制器主控板电路V3_系统管理 (R50.2 R57.2), 海关全向控制器主控板电路V3_主控芯片 (U5.27)
Vedio_CH3: 海关全向控制器主控板电路V3_系统管理 (R53.2 R56.2), 海关全向控制器主控板电路V3_主控芯片 (U5.28)